# EasyEDA Pro project RackEth.eprj

# Schematic RackEth
Board Name: RackEth; Create Date: 2024-12-09; Page Name: RackEth; Project Name: RackEth; Schematic Name: RackEth; Update Date: 2025-03-17; Company: EasyEDA.com; Drawn: EasyEDA; Page Size: A4; Part Number: JLCPCB-002; Reviewed: EasyEDA; Version: V0.1
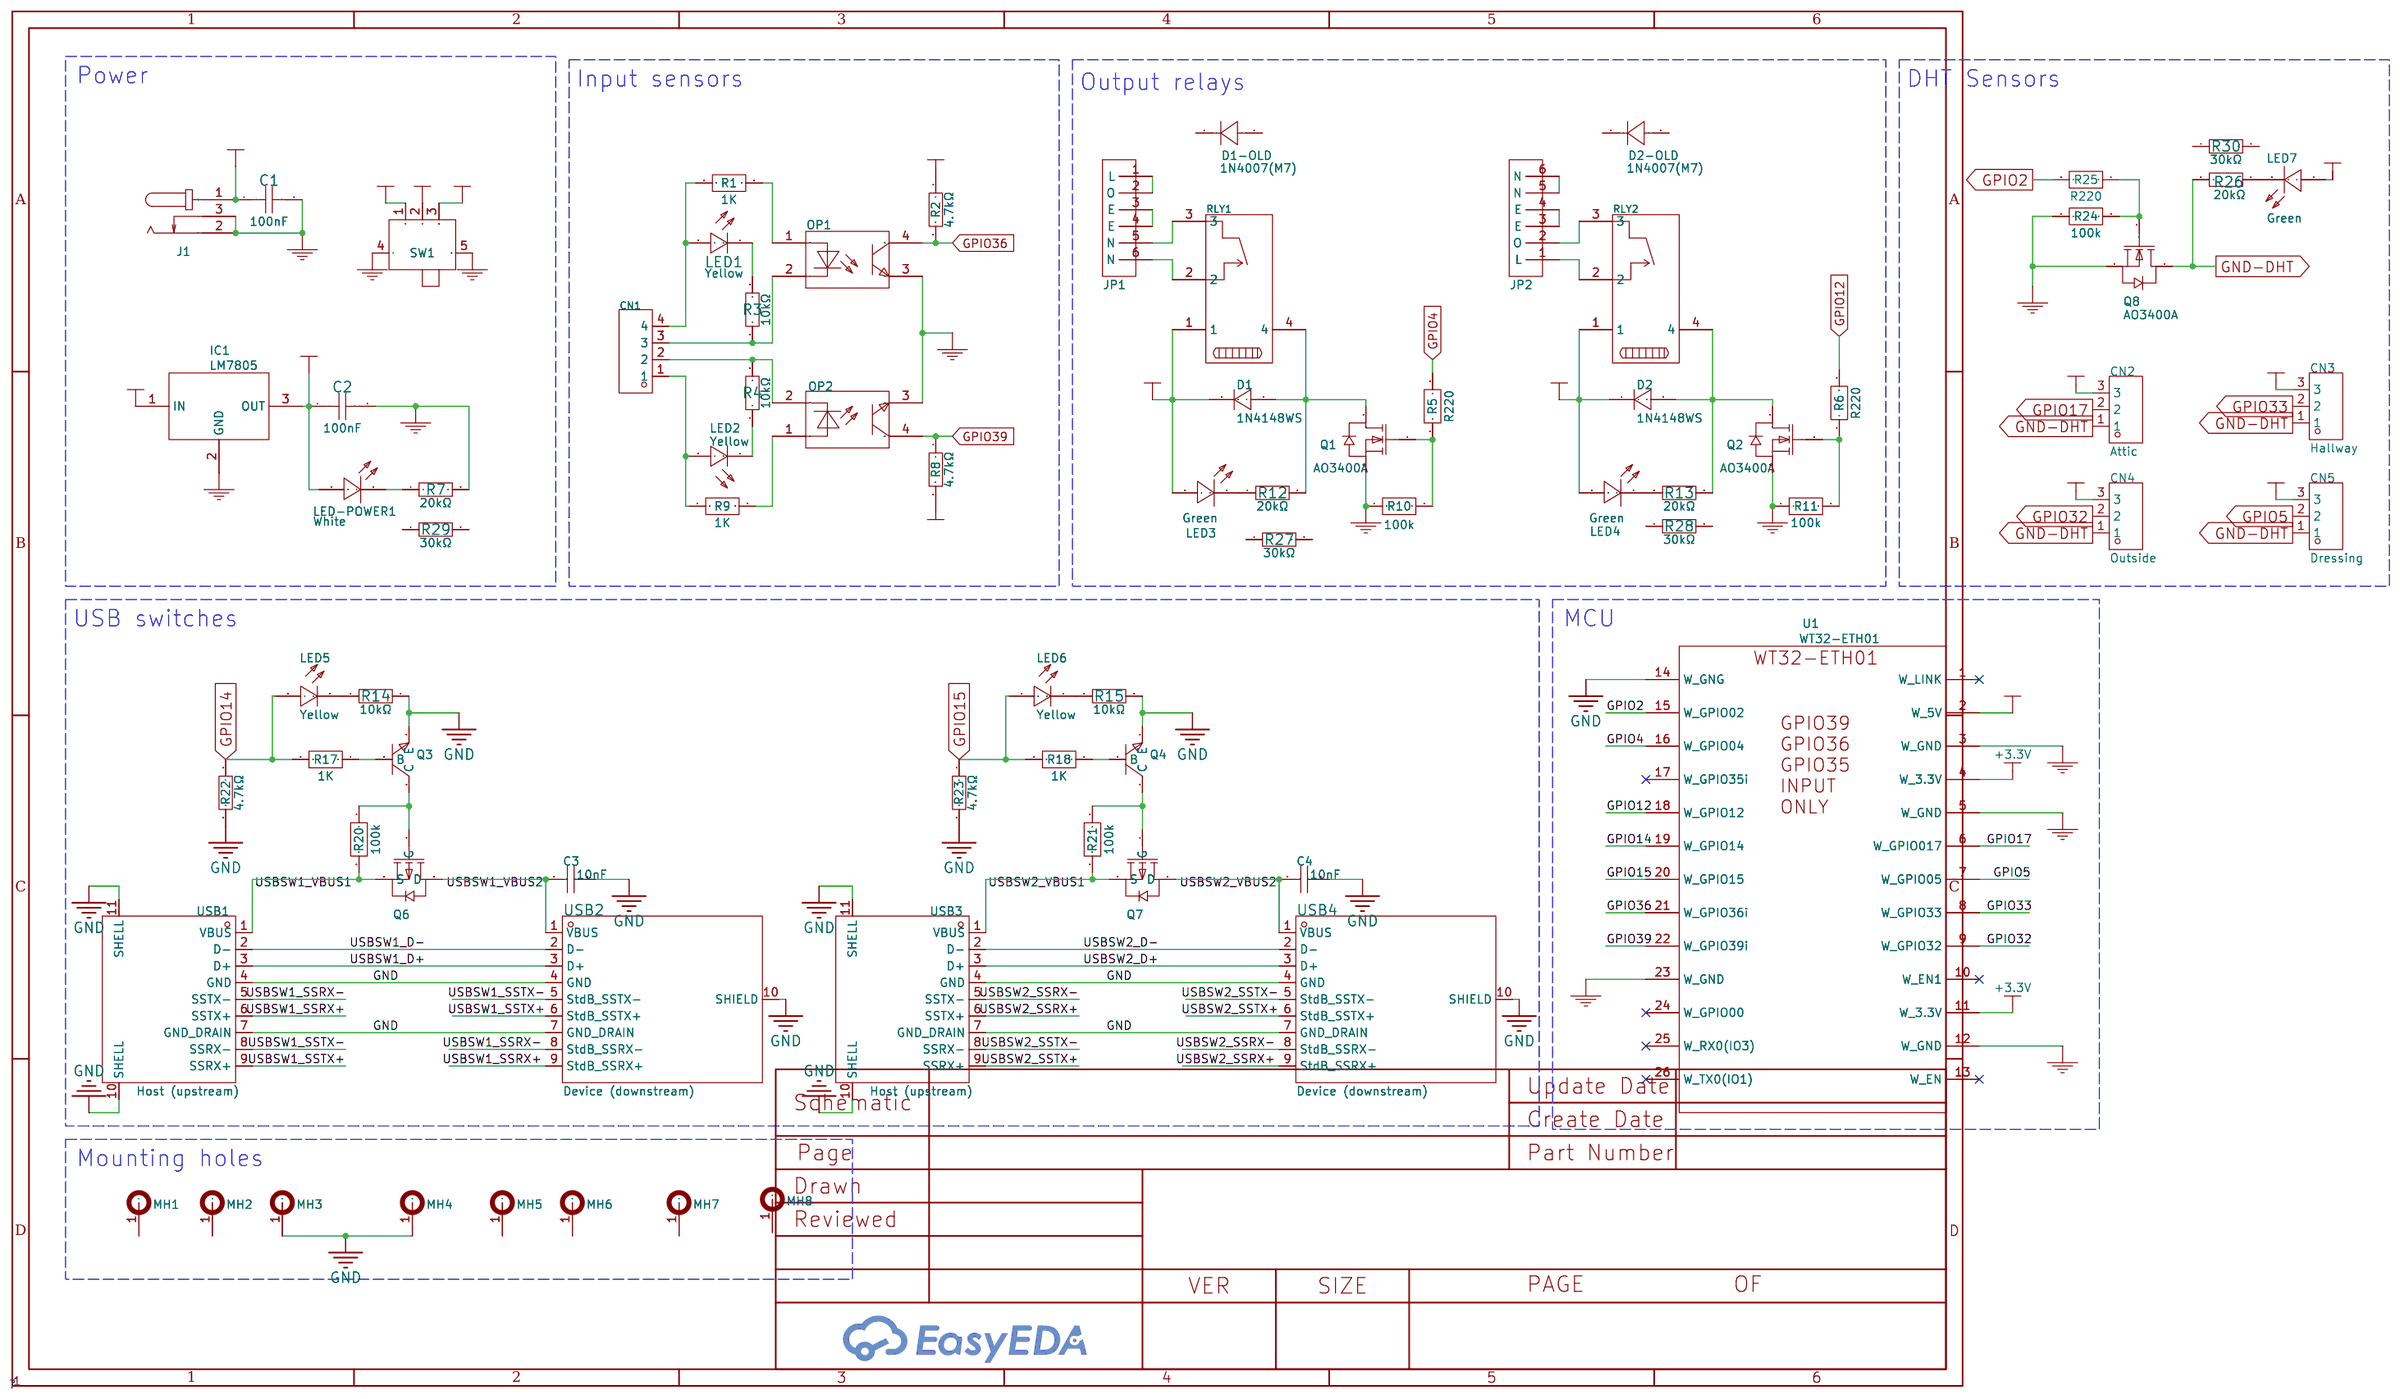
[diagram p0: schematic sheet]

## Parts
C1  100nF  [C0603]
C2  100nF  [C0603]
C3  10nF  [C0402]
C4  10nF  [C0402]
CN1  WJ127-5.0-4P  [CONN-TH_4P-P5.00_WJ127-5.0-4P]  (no BOM)
CN2  Attic  [CONN-TH_3P-P2.50_HCTL_XH-3A-L]  (no BOM)
CN3  Hallway  [CONN-TH_3P-P2.50_HCTL_XH-3A-L]  (no BOM)
CN4  Outside  [CONN-TH_3P-P2.50_HCTL_XH-3A-L]  (no BOM)
CN5  Dressing  [CONN-TH_3P-P2.50_HCTL_XH-3A-L]  (no BOM)
D1  1N4148WS  [SOD-323_L1.8-W1.3-LS2.5-RD]
D1-OLD  1N4007(M7)  [SMA_L4.3-W2.7-LS5.1-RD]  (no BOM)
D2  1N4148WS  [SOD-323_L1.8-W1.3-LS2.5-RD]
D2-OLD  1N4007(M7)  [SMA_L4.3-W2.7-LS5.1-RD]  (no BOM)
IC1  LM7805  [LM7805]  (no BOM)
J1  DC005-2.1x5.5mm  [DC-IN-TH_POWER-JACK]  (no BOM)
JP1  JP1  [CONN-TH_6P-P5.00_WJ127-5.0-6P]  (no BOM)
JP2  JP2  [CONN-TH_6P-P5.00_WJ127-5.0-6P]  (no BOM)
LED1  Yellow  [LED0603-RD-YELLOW]
LED2  Yellow  [LED0603-RD-YELLOW]
LED3  Green  [LED0805-RD_GREEN]
LED4  Green  [LED0805-RD_GREEN]
LED5  Yellow  [LED0603-RD-YELLOW]
LED6  Yellow  [LED0603-RD-YELLOW]
LED7  Green  [LED0805-RD_GREEN]
LED-POWER1  White  [LED0603-R-RD_WHITE]
MH1  -  [MH_7.5x4mm]  (no BOM)
MH2  -  [MH_7.5x4mm]  (no BOM)
MH3  -  [MH_7.5x4mm]  (no BOM)
MH4  -  [MH_7.5x4mm]  (no BOM)
MH5  -  [MH_6x3.2mm]  (no BOM)
MH6  -  [MH_6x3.2mm]  (no BOM)
MH7  -  [MH_6x3.2mm]  (no BOM)
MH8  -  [MH_6x3.2mm]  (no BOM)
OP1  EL817S1(C)(TU)-F  [OPTO-SMD-4_L4.6-W6.5-P2.54-LS10.3-TL]
OP2  EL817S1(C)(TU)-F  [OPTO-SMD-4_L4.6-W6.5-P2.54-LS10.3-TL]
Q1  AO3400A  [SOT-23-3_L2.9-W1.6-P1.90-LS2.8-BR]
Q2  AO3400A  [SOT-23-3_L2.9-W1.6-P1.90-LS2.8-BR]
Q3  MMBT3904(RANGE:100-300)  [SOT-23-3_L2.9-W1.3-P1.90-LS2.4-BR]
Q4  MMBT3904(RANGE:100-300)  [SOT-23-3_L2.9-W1.3-P1.90-LS2.4-BR]
Q6  AO3401A  [SOT-23_L2.9-W1.3-P1.90-LS2.4-BR]
Q7  AO3401A  [SOT-23_L2.9-W1.3-P1.90-LS2.4-BR]
Q8  AO3400A  [SOT-23-3_L2.9-W1.6-P1.90-LS2.8-BR]
R1  1K  [R0603]
R2  4.7kΩ  [R0603]
R3  10kΩ  [R0603]
R4  10kΩ  [R0603]
R5  R220  [R0603]
R6  R220  [R0603]
R7  20kΩ  [R0603]
R8  4.7kΩ  [R0603]
R9  1K  [R0603]
R10  100k  [R0603]
R11  100k  [R0603]
R12  20kΩ  [R0603]
R13  20kΩ  [R0603]
R14  10kΩ  [R0603]
R15  10kΩ  [R0603]
R17  1K  [R0603]
R18  1K  [R0603]
R20  100k  [R0603]
R21  100k  [R0603]
R22  4.7kΩ  [R0603]
R23  4.7kΩ  [R0603]
R24  100k  [R0603]
R25  R220  [R0603]
R26  20kΩ  [R0603]
R27  30kΩ  [R0603]  (no BOM)
R28  30kΩ  [R0603]  (no BOM)
R29  30kΩ  [R0603]  (no BOM)
R30  30kΩ  [R0603]  (no BOM)
RLY1  G5NB-1A-E-DC5V  [RELAY-TH_G5NB-1A-E-DCXX]  (no BOM)
RLY2  G5NB-1A-E-DC5V  [RELAY-TH_G5NB-1A-E-DCXX]  (no BOM)
SW1  SS12D07VG3 087  [SW-TH_SS12D07VG4]
U1  WT32-ETH01  [WT32-ETH01-M]  (no BOM)
USB1  Host (upstream)  [USB3.0-TH_U235-09XN-2XC2-002]
USB2  Device (downstream)  [USB3.0-A-SMD_916-862A205EY10200]
USB3  Host (upstream)  [USB3.0-TH_U235-09XN-2XC2-002]
USB4  Device (downstream)  [USB3.0-A-SMD_916-862A205EY10200]

## Library data of the parts
C1 C2 = CC0603KRX7R9BB104: LCSC Part Name: 100nF ±10% 50V; Supplier Part: C14663; Manufacturer: YAGEO(国巨); Supplier Footprint: 0603; JLCPCB Part Class: Basic Part; Datasheet: https://atta.szlcsc.com/upload/public/pdf/source/20180910/C282072_33301C7F631E79921B82A8DAC6BCC5B3.pdf; Supplier: LCSC; Tolerance: ±10%
C3 C4 = CL05B103KB5NNNC: LCSC Part Name: 10nF ±10% 50V; Supplier Part: C15195; Manufacturer: SAMSUNG(三星); Supplier Footprint: 0402; JLCPCB Part Class: Basic Part; Datasheet: https://atta.szlcsc.com/upload/public/pdf/source/20160218/1457707763339.pdf; Supplier: LCSC; Tolerance: ±10%
CN1 = WJ127-5.0-4P: LCSC Part Name: 5mm 1x4P 排数:1 每排P数:4 直插; Supplier Part: C192779; Manufacturer: KANGNEX(康奈克斯电气); Supplier Footprint: 插件,P=5mm; JLCPCB Part Class: Extended Part; Datasheet: https://atta.szlcsc.com/upload/public/pdf/source/20191225/C192779_DBD79F61C9FABD31EC3EFBBD98D95251.pdf; Supplier: LCSC; Structure: 1x4P; Pitch: 5mm; Color: Green; Mounting Style: Straight; Current Rating (Max): 15A; Voltage Rating (Max): 250V; Number of Pins: 4P; Number of Rows: 1; Wire Gauge - AWG: 14~26; Wire Gauge - mm2: 1.5; Number of PINs Per Row: 4; Operating Temperature Range: -40℃~+105℃
CN2-CN5 = XH2.54-3A: Supplier Part: C9900018379; Supplier: LCSC
D1 D2 = 1N4148WS_C2128: LCSC Part Name: 丝印T4; Supplier Part: C2128; Manufacturer: CJ(江苏长电/长晶); Supplier Footprint: SOD-323; JLCPCB Part Class: Basic Part; Datasheet: https://atta.szlcsc.com/upload/public/pdf/source/20140809/1457707208178.pdf; Supplier: LCSC; Diode Configuration: Independent Type; Forward Voltage (Vf@If): 1.25V@150mA; Reverse Leakage Current (Ir): 1uA@75V
D1-OLD D2-OLD = 1N4007(M7): Supplier: LCSC; Supplier Part: C2988638; Manufacturer: UMW(友台半导体); JLCPCB Part Class: Extended Part
IC1 = LM7805: sim: true
J1 = DC005-2.1x5.5mm: Supplier: LCSC; Supplier Part: C9900001795; Manufacturer: 索峰; Manufacturer Part: POWER-JACK; JLCPCB Part Class: Extended Part
JP1 JP2 = Terminal?: Supplier Part: 6P Terminal Block Connector 5.0mm; Supplier: Amazon; link: https://www.amazon.com/gp/product/B00NWEC8TW
LED1 LED2 LED5 LED6 = 19-213/Y2C-CQ2R2L/3T(CY): LCSC Part Name: 黄灯; Supplier Part: C72038; Manufacturer: EVERLIGHT(亿光); Supplier Footprint: 0603; JLCPCB Part Class: Basic Part; Datasheet: https://atta.szlcsc.com/upload/public/pdf/source/20160507/1462613613586.pdf; Supplier: LCSC; Power Dissipation: 60mW; Forward Current: 20mA; Dominant Wavelength: 585.5nm~591.5nm; Peak Wavelength: 591nm; Lens Color: 无色透明透镜; Viewing Angle: 120°; Operating Temperature: -40℃~+85℃
LED3 LED4 LED7 = 0805G (Green): Supplier: LCSC; Manufacturer: KENTO; Supplier Part: C2297; JLCPCB Part Class: Basic Part
LED-POWER1 = 0603White light_C2290: Supplier: LCSC; Manufacturer: KENTO; Manufacturer Part: KT-0603W; Supplier Part: C2290; JLCPCB Part Class: Basic Part
MH1-MH4 = MH_7.5x4mm
MH5-MH8 = MH_6x3.2mm
OP1 OP2 = EL817S1(C)(TU)-F: Supplier: LCSC; Manufacturer: EVERLIGHT(亿光); Supplier Part: C106900; JLCPCB Part Class: Basic Part
Q1 Q2 Q8 = AO3400A: Supplier: LCSC; Manufacturer: AOS; Supplier Part: C20917; JLCPCB Part Class: Basic Part
Q3 Q4 = MMBT3904(RANGE:100-300): Transistor Type: Collector Current (Ic): Collector-Emitter Breakdown Voltage (Vceo): Power Dissipation (Pd): DC Current Gain (hFE@Ic,Vce):100@10mA,1V DC Current Gain (hFE@Ic,Vce):100@10mA,1V Transition Frequency (fT):300MHz Collector Cut-Off Current (Icbo; LCSC Part Name: NPN 电流:200mA 耐压:40V hfe=100~300; Supplier Part: C20526; Manufacturer: CJ(江苏长电/长晶); Supplier Footprint: SOT-23; JLCPCB Part Class: Basic Part; Datasheet: https://atta.szlcsc.com/upload/public/pdf/source/20220704/70F575FB75061E03F919270A6BB8BA7F.pdf; Supplier: LCSC; DC Current Gain (hFE@Ic,Vce): 100@10mA,1V; Transition Frequency (fT): 300MHz; Collector Cut-Off Current (Icbo): 100nA; Collector-Emitter Saturation Voltage (VCE(sat)@Ic,Ib): 300mV@50mA,5mA
Q6 Q7 = AO3401A_C15127: Type:1 Piece P-Channel Drain Source Voltage (Vdss): Continuous Drain Current (Id): Drain Source On Resistance (RDS(on)@Vgs,Id):44mΩ@10V,4.3A Power Dissipation (Pd): Gate Threshold Voltage (Vgs(th)@Id):1.3V@250uA Total Gate Charge (Qg@Vgs):12.2nC@4.5V Inpu; LCSC Part Name: 1个P沟道 耐压:30V 电流:4A; Supplier Part: C15127; Manufacturer: AOS; Supplier Footprint: SOT-23; JLCPCB Part Class: Basic Part; Datasheet: https://atta.szlcsc.com/upload/public/pdf/source/20160507/1462613609053.pdf; Supplier: LCSC; Type: 1 Piece P-Channel; Drain Source On Resistance (RDS(on)@Vgs,Id): 44mΩ@10V,4.3A; Gate Threshold Voltage (Vgs(th)@Id): 1.3V@250uA; Total Gate Charge (Qg@Vgs): 12.2nC@4.5V; Input Capacitance (Ciss@Vds): 1.2nF@15V; Operating Temperature: -55℃~+150℃@(Tj)
R1 R9 R17 R18 = 1K: Supplier Part: C21190; Supplier: LCSC; Manufacturer Part: 0603WAF1001T5E; Manufacturer: UNI-ROYAL(厚声)
R2 R8 R22 R23 = 0603WAF4701T5E: LCSC Part Name: 4.7kΩ ±1% 100mW 厚膜电阻; Supplier Part: C23162; Manufacturer: UNI-ROYAL(厚声); Supplier Footprint: 0603; JLCPCB Part Class: Basic Part; Datasheet: https://atta.szlcsc.com/upload/public/pdf/source/20200306/C422600_1E6D84923E4A46A82E41ADD87F860B5C.pdf; Supplier: LCSC; Type: Thick Film Resistors; Tolerance: ±1%; Temperature Coefficient: ±100ppm/℃; Operating Temperature Range: -55℃~+155℃
R3 R4 R14 R15 = 0603WAF1002T5E: LCSC Part Name: 厚膜电阻 10kΩ ±1% 100mW; Supplier Part: C25804; Manufacturer: UNI-ROYAL(厚声); Supplier Footprint: 0603; JLCPCB Part Class: Basic Part; Datasheet: https://atta.szlcsc.com/upload/public/pdf/source/20200306/C422600_1E6D84923E4A46A82E41ADD87F860B5C.pdf; Supplier: LCSC; Type: Thick Film Resistors; Tolerance: ±1%; Temperature Coefficient: ±100ppm/℃; Operating Temperature Range: -55℃~+155℃
R5 R6 R25 = R220: Supplier Part: C22962; Supplier: LCSC; Manufacturer Part: 0603WAF2200T5E; Manufacturer: UNI-ROYAL(厚声)
R7 R12 R13 R26 = 0603WAF2002T5E: LCSC Part Name: 20kΩ ±1% 100mW 厚膜电阻; Supplier Part: C4184; Manufacturer: UNI-ROYAL(厚声); Supplier Footprint: 0603; JLCPCB Part Class: Basic Part; Datasheet: https://atta.szlcsc.com/upload/public/pdf/source/20200306/C422600_1E6D84923E4A46A82E41ADD87F860B5C.pdf; Supplier: LCSC; Type: Thick Film Resistors; Tolerance: ±1%; Temperature Coefficient: ±100ppm/℃; Operating Temperature Range: -55℃~+155℃
R10 R11 R20 R21 R24 = 100k: Supplier Part: C25803; Supplier: LCSC; Manufacturer Part: 0603WAF1003T5E; Manufacturer: UNI-ROYAL(厚声)
R27-R30 = 0603WAF3002T5E: LCSC Part Name: 30kΩ ±1% 100mW 厚膜电阻; Supplier Part: C22984; Manufacturer: UNI-ROYAL(厚声); Supplier Footprint: 0603; JLCPCB Part Class: Basic Part; Datasheet: https://atta.szlcsc.com/upload/public/pdf/source/20200306/C422600_1E6D84923E4A46A82E41ADD87F860B5C.pdf; Supplier: LCSC; Type: Thick Film Resistors; Tolerance: ±1%; Temperature Coefficient: ±100ppm/℃; Operating Temperature Range: -55℃~+155℃
RLY1 RLY2 = G5NB-1A-E-DC5V: Coil Voltage:- Contact Form:- Pin Number:- Contact Rating:- Maximum Switching Voltage:- Contact Material:- Maximum Switching Current:- Coil Type: Coil Resistance:- Contact Resistance:- Operate Time:- Release Time:- Operating Temperature:- Operating Temper; Supplier Part: C48746; Manufacturer: OMRON(欧姆龙); Supplier Footprint: 插件,7x20.4mm; JLCPCB Part Class: Extended Part; Supplier: LCSC
SW1 = SS12D07VG3 087: Supplier Part: C2939725; Manufacturer: SHOU HAN(首韩); Supplier Footprint: 插件; JLCPCB Part Class: Extended Part; Datasheet: https://atta.szlcsc.com/upload/public/pdf/source/20220106/77EDD450BA7545A1F1665F035F54D3A4.pdf; Supplier: LCSC; Circuit: SPDT; Pin Style: PCPin; Switch Length: 8.7mm; Switch Width: 4.4mm; Switch Height: 4.7mm; Mounting Style: Straight; Current Rating (DC): 500mA; Voltage Rating (DC): 50V; Mechanical Life: 5千次; Operating Temperature: -10℃~+50℃
U1 = WT32-ETH01: Manufacturer: Wireless-Tag; link: http://www.wireless-tag.com/wp-content/uploads/2020/08/WT32-ETH01规格书V1.2EN（英文）.pdf
USB1 USB3 = U235-091N-2UC2-002: LCSC Part Name: Type-B 母; Supplier Part: C2879842; Manufacturer: XKB Connection(中国星坤); Supplier Footprint: 插件; JLCPCB Part Class: Extended Part; Datasheet: https://atta.szlcsc.com/upload/public/pdf/source/20220919/F7A9F5F63B3D22A8342A73DEDBEAF374.pdf; Supplier: LCSC; Connector Type: Type-B; Gender: Female; Number of Contacts: 9P; Number of Ports: 1; Current Rating - Power (Max): 1.8A; Contact Material: Copper alloy; Contact Plating: Gold; Operating Temperature Range: -55℃~+85℃; Soldering Temperature(Max): 235℃
USB2 USB4 = 916-862A205EY10200: LCSC Part Name: Type-A 母 夹板; Supplier Part: C2763055; Manufacturer: 精拓金; Supplier Footprint: SMD; JLCPCB Part Class: Extended Part; Datasheet: https://atta.szlcsc.com/upload/public/pdf/source/20210526/C2763055_64B60A99F4A404C7F2E7F9F6F4497CDD.pdf; Supplier: LCSC; Connector Type: Type-A; Standard: USB 3.0; Gender: Female; Number of Ports: 1; Number of Contacts: 9P; Mounting Style: Board Edge, Straddle Mount; Current Rating - Power (Max): 1A; Operating Temperature Range: -25℃~+85℃

## Nets
+3.3V: CN2.3 CN3.3 CN4.3 CN5.3 LED7.2(A) R2.1 R8.2 U1.4(W_3.3V) U1.11(W_3.3V)
+5V: C2.1 D1.1(K) D2.1(K) IC1.3(OUT) LED3.2(A) LED4.2(A) LED-POWER1.1(A) RLY1.1 RLY2.1 SW1.1 U1.2(W_5V)
GND: C1.2 C2.2 C3.1 C4.1 IC1.2(GND) J1.2(GND) J1.3 MH3.1 MH4.1 OP1.3(EM) OP2.3(EM) Q1.2(S) Q2.2(S) Q3.2(E) Q4.2(E) Q8.2(S) R7.2 R10.1 R11.1 R14.1 R15.1 R22.2 R23.2 R24.1 SW1.4 SW1.5 U1.3(W_GND) U1.5(W_GND) U1.12(W_GND) U1.14(W_GNG) U1.23(W_GND) USB1.4(GND) USB1.7(GND_DRAIN) USB1.10(SHELL) USB1.11(SHELL) USB2.4(GND) USB2.7(GND_DRAIN) USB2.10(SHIELD) USB3.4(GND) USB3.7(GND_DRAIN) USB3.10(SHELL) USB3.11(SHELL) USB4.4(GND) USB4.7(GND_DRAIN) USB4.10(SHIELD)
GND-DHT: CN2.1 CN3.1 CN4.1 CN5.1 Q8.3(D) R26.2
VCC: IC1.1(IN) SW1.3
VCC-IN: C1.1 J1.1(VCC) SW1.2
GPIO2: R25.2 U1.15(W_GPIO02)
GPIO4: R5.2 U1.16(W_GPIO04)
GPIO5: CN5.2 U1.7(W_GPIO05)
GPIO12: R6.2 U1.18(W_GPIO12)
GPIO14: LED5.2(A) R17.2 R22.1 U1.19(W_GPIO14)
GPIO15: LED6.2(A) R18.2 R23.1 U1.20(W_GPIO15)
GPIO17: CN2.2 U1.6(W_GPIO017)
GPIO32: CN4.2 U1.9(W_GPIO32)
GPIO33: CN3.2 U1.8(W_GPIO33)
GPIO36: OP1.4(COL) R2.2 U1.21(W_GPIO36i)
GPIO39: OP2.4(COL) R8.1 U1.22(W_GPIO39i)
USBSW1_D+: USB1.3(D+) USB2.3(D+)
USBSW1_D-: USB1.2(D-) USB2.2(D-)
USBSW1_SSRX+: USB1.6(SSTX+) USB2.9(StdB_SSRX+)
USBSW1_SSRX-: USB1.5(SSTX-) USB2.8(StdB_SSRX-)
USBSW1_SSTX+: USB1.9(SSRX+) USB2.6(StdB_SSTX+)
USBSW1_SSTX-: USB1.8(SSRX-) USB2.5(StdB_SSTX-)
USBSW1_VBUS1: Q6.2(S) R20.2 USB1.1(VBUS)
USBSW1_VBUS2: C3.2 Q6.3(D) USB2.1(VBUS)
USBSW2_D+: USB3.3(D+) USB4.3(D+)
USBSW2_D-: USB3.2(D-) USB4.2(D-)
USBSW2_SSRX+: USB3.6(SSTX+) USB4.9(StdB_SSRX+)
USBSW2_SSRX-: USB3.5(SSTX-) USB4.8(StdB_SSRX-)
USBSW2_SSTX+: USB3.9(SSRX+) USB4.6(StdB_SSTX+)
USBSW2_SSTX-: USB3.8(SSRX-) USB4.5(StdB_SSTX-)
USBSW2_VBUS1: Q7.2(S) R21.2 USB3.1(VBUS)
USBSW2_VBUS2: C4.2 Q7.3(D) USB4.1(VBUS)
$1N3: D1.2(A) Q1.3(D) R12.2 RLY1.4
$1N5: Q1.1(G) R5.1 R10.2
$1N16: LED-POWER1.2(K) R7.1
$1N18: D2.2(A) Q2.3(D) R13.2 RLY2.4
$1N19: LED4.1(K) R13.1
$1N25: Q2.1(G) R6.1 R11.2
$1N58: OP1.1(AN) R1.1
$1N59: CN1.4 LED1.2(A) R1.2
$1N4552: JP2.3(E) JP2.4(E)
$1N4588: JP1.6(N) RLY1.2
$1N4592: JP1.5(N) RLY1.3
$1N4597: JP1.3(E) JP1.4(E)
$1N4602: JP1.1(L) JP1.2(O)
$1N4658: JP2.2(O) RLY2.3
$1N4661: JP2.1(L) RLY2.2
$1N4663: JP2.5(N) JP2.6(N)
$1N12669: CN1.3 OP1.2(CAT) R3.1
$1N27876: CN1.2 OP2.2(CAT) R4.2
$1N27969: LED1.1(C) R3.2
$1N27997: CN1.1 LED2.2(A) R9.1
$1N28002: OP2.1(AN) R9.2
$1N28006: LED2.1(C) R4.1
$1N30826: LED3.1(K) R12.1
$1N38985: Q3.1(B) R17.1
$1N38986: Q3.3(C) Q6.1(G) R20.1
$1N41846: Q4.1(B) R18.1
$1N41847: Q4.3(C) Q7.1(G) R21.1
$1N49685: LED5.1(C) R14.2
$1N49709: LED6.1(C) R15.2
$1N52596: Q8.1(G) R24.2 R25.1
$1N53145: LED7.1(K) R26.1

Not connected (* = marked no-connect by the designer): D1-OLD 1(K) 2(A); D2-OLD 1(K) 2(A); MH1 1; MH2 1; MH5 1; MH6 1; MH7 1; MH8 1; R27 1 2; R28 1 2; R29 1 2; R30 1 2; U1 1(W_LINK)* 10(W_EN1)* 13(W_EN)* 17(W_GPIO35i)* 24(W_GPIO00)* 25(W_RX0(IO3))* 26(W_TX0(IO1))*

## Notes on the sheet
- Power
- Input sensors
- Output relays
- DHT Sensors
- USB switches
- MCU
- Mounting holes

# Board RackEth
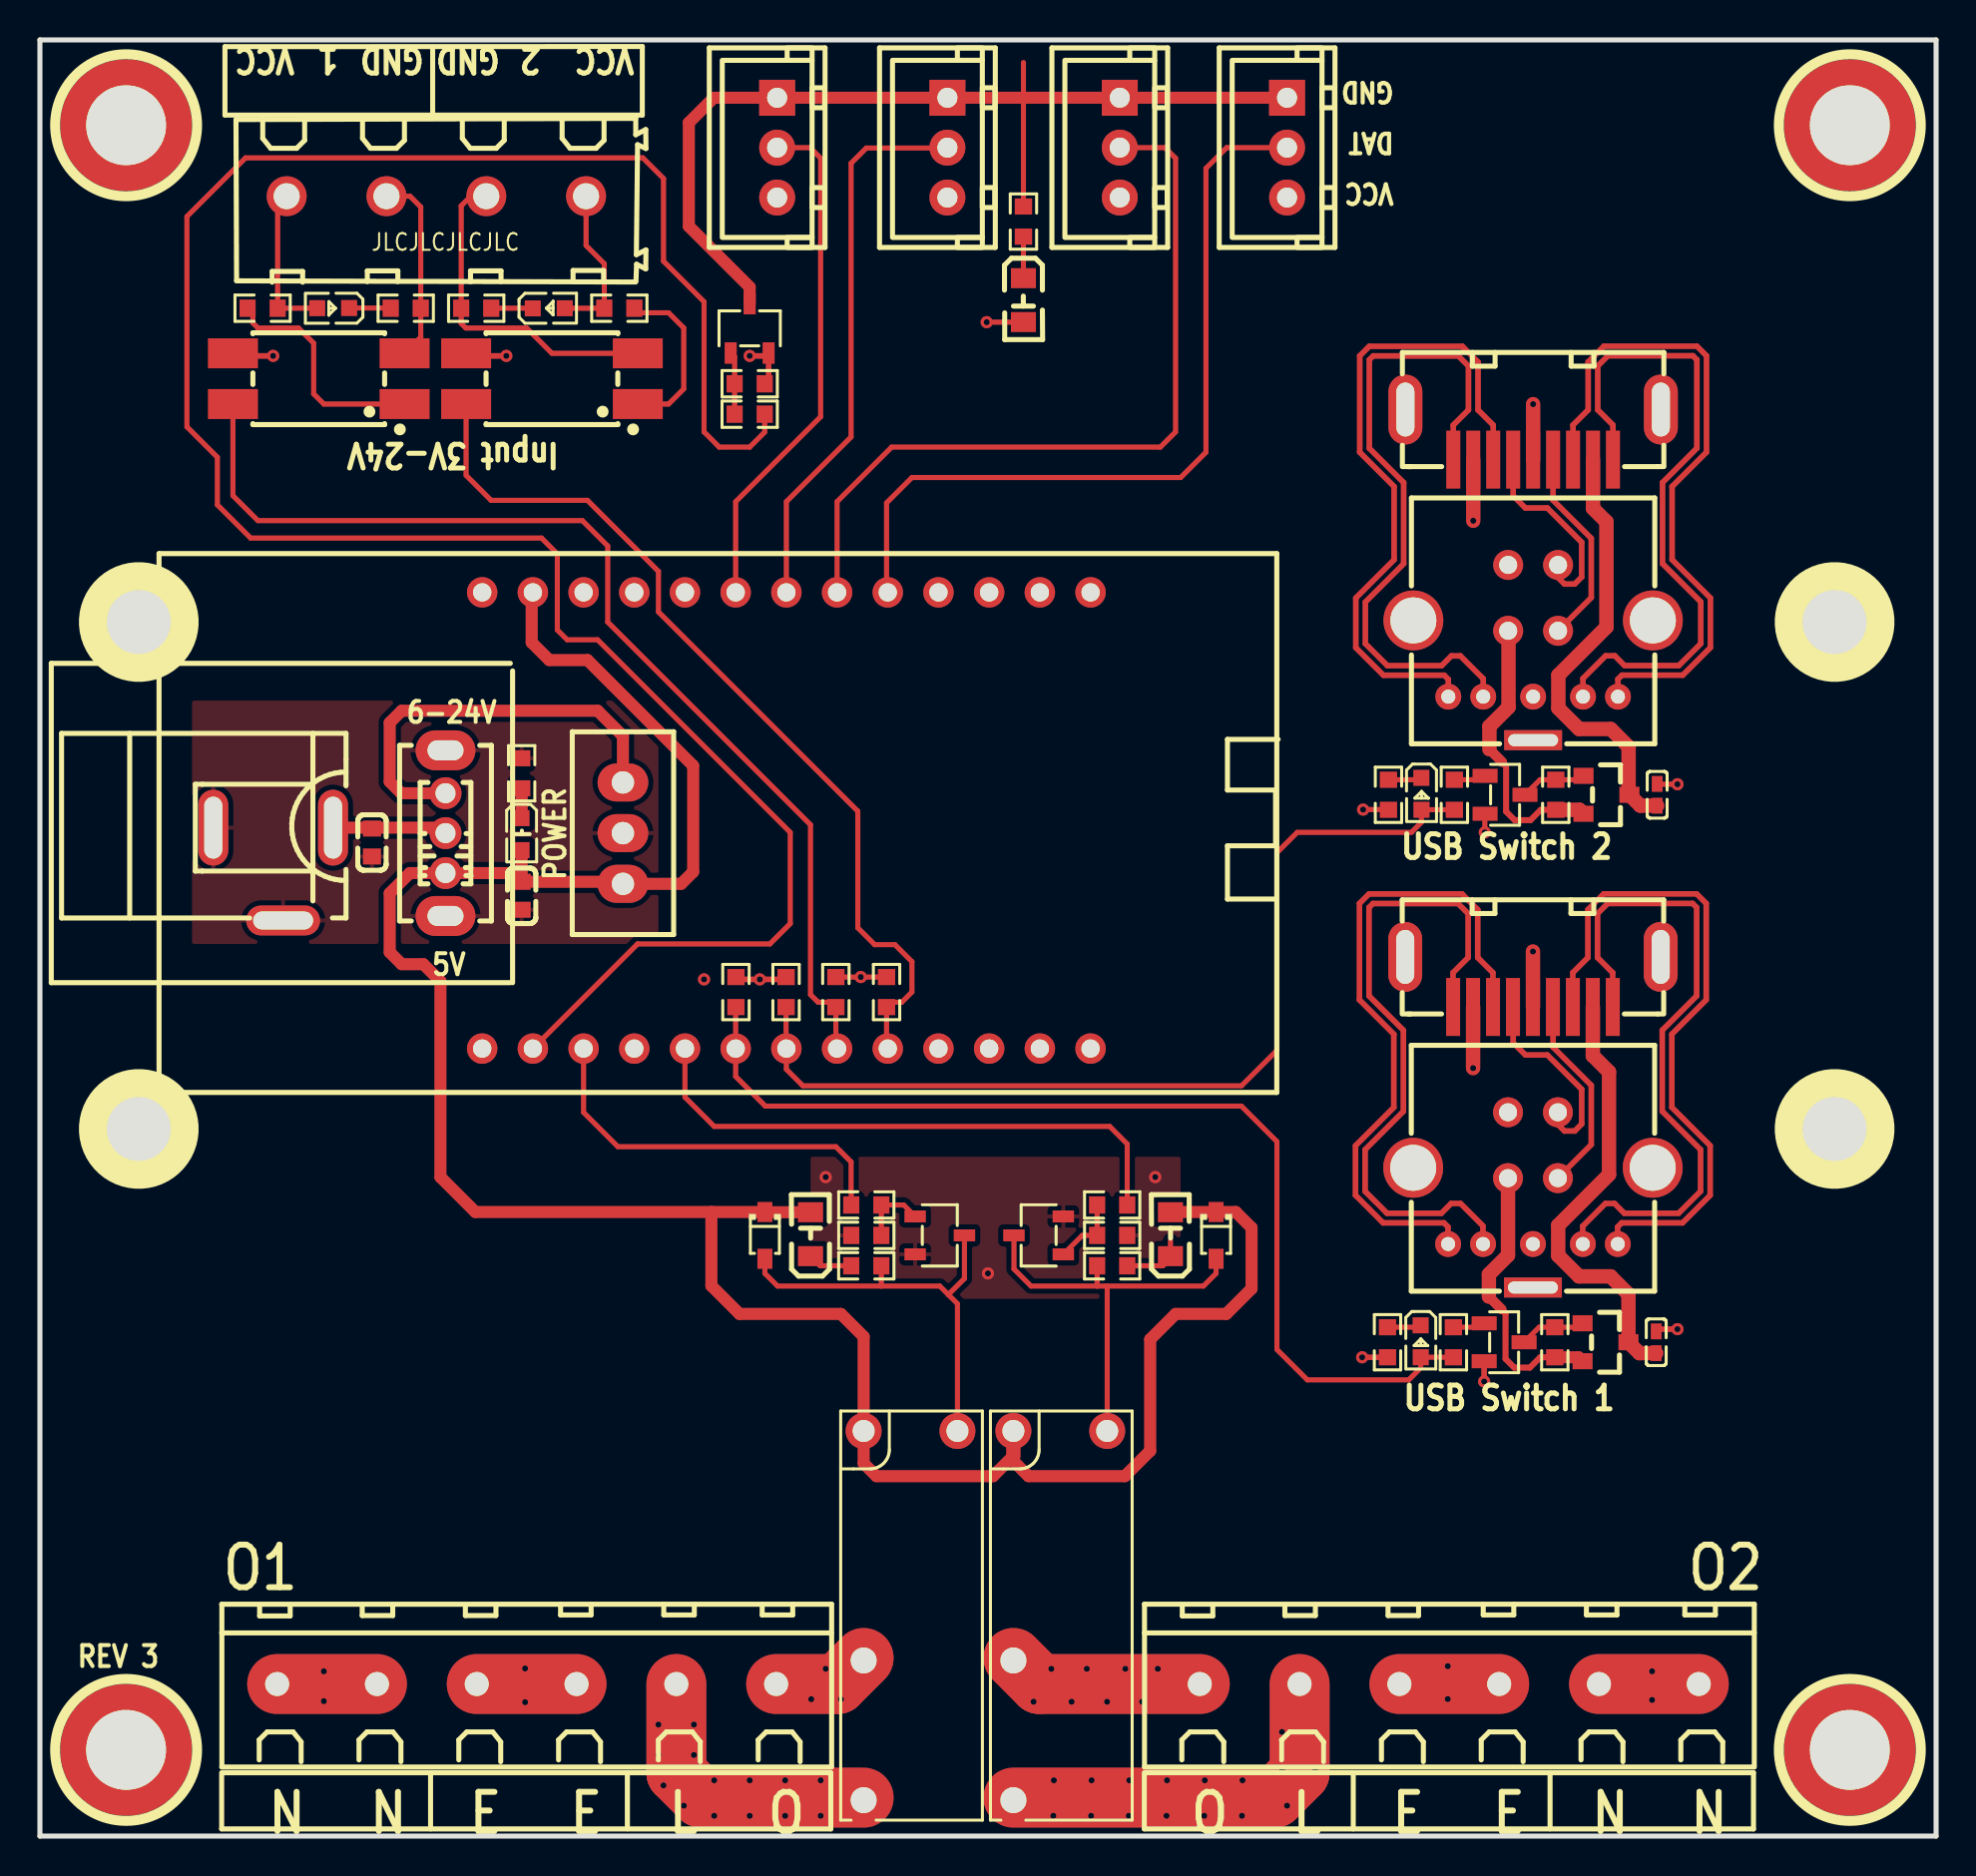
[diagram p1: board, top side]
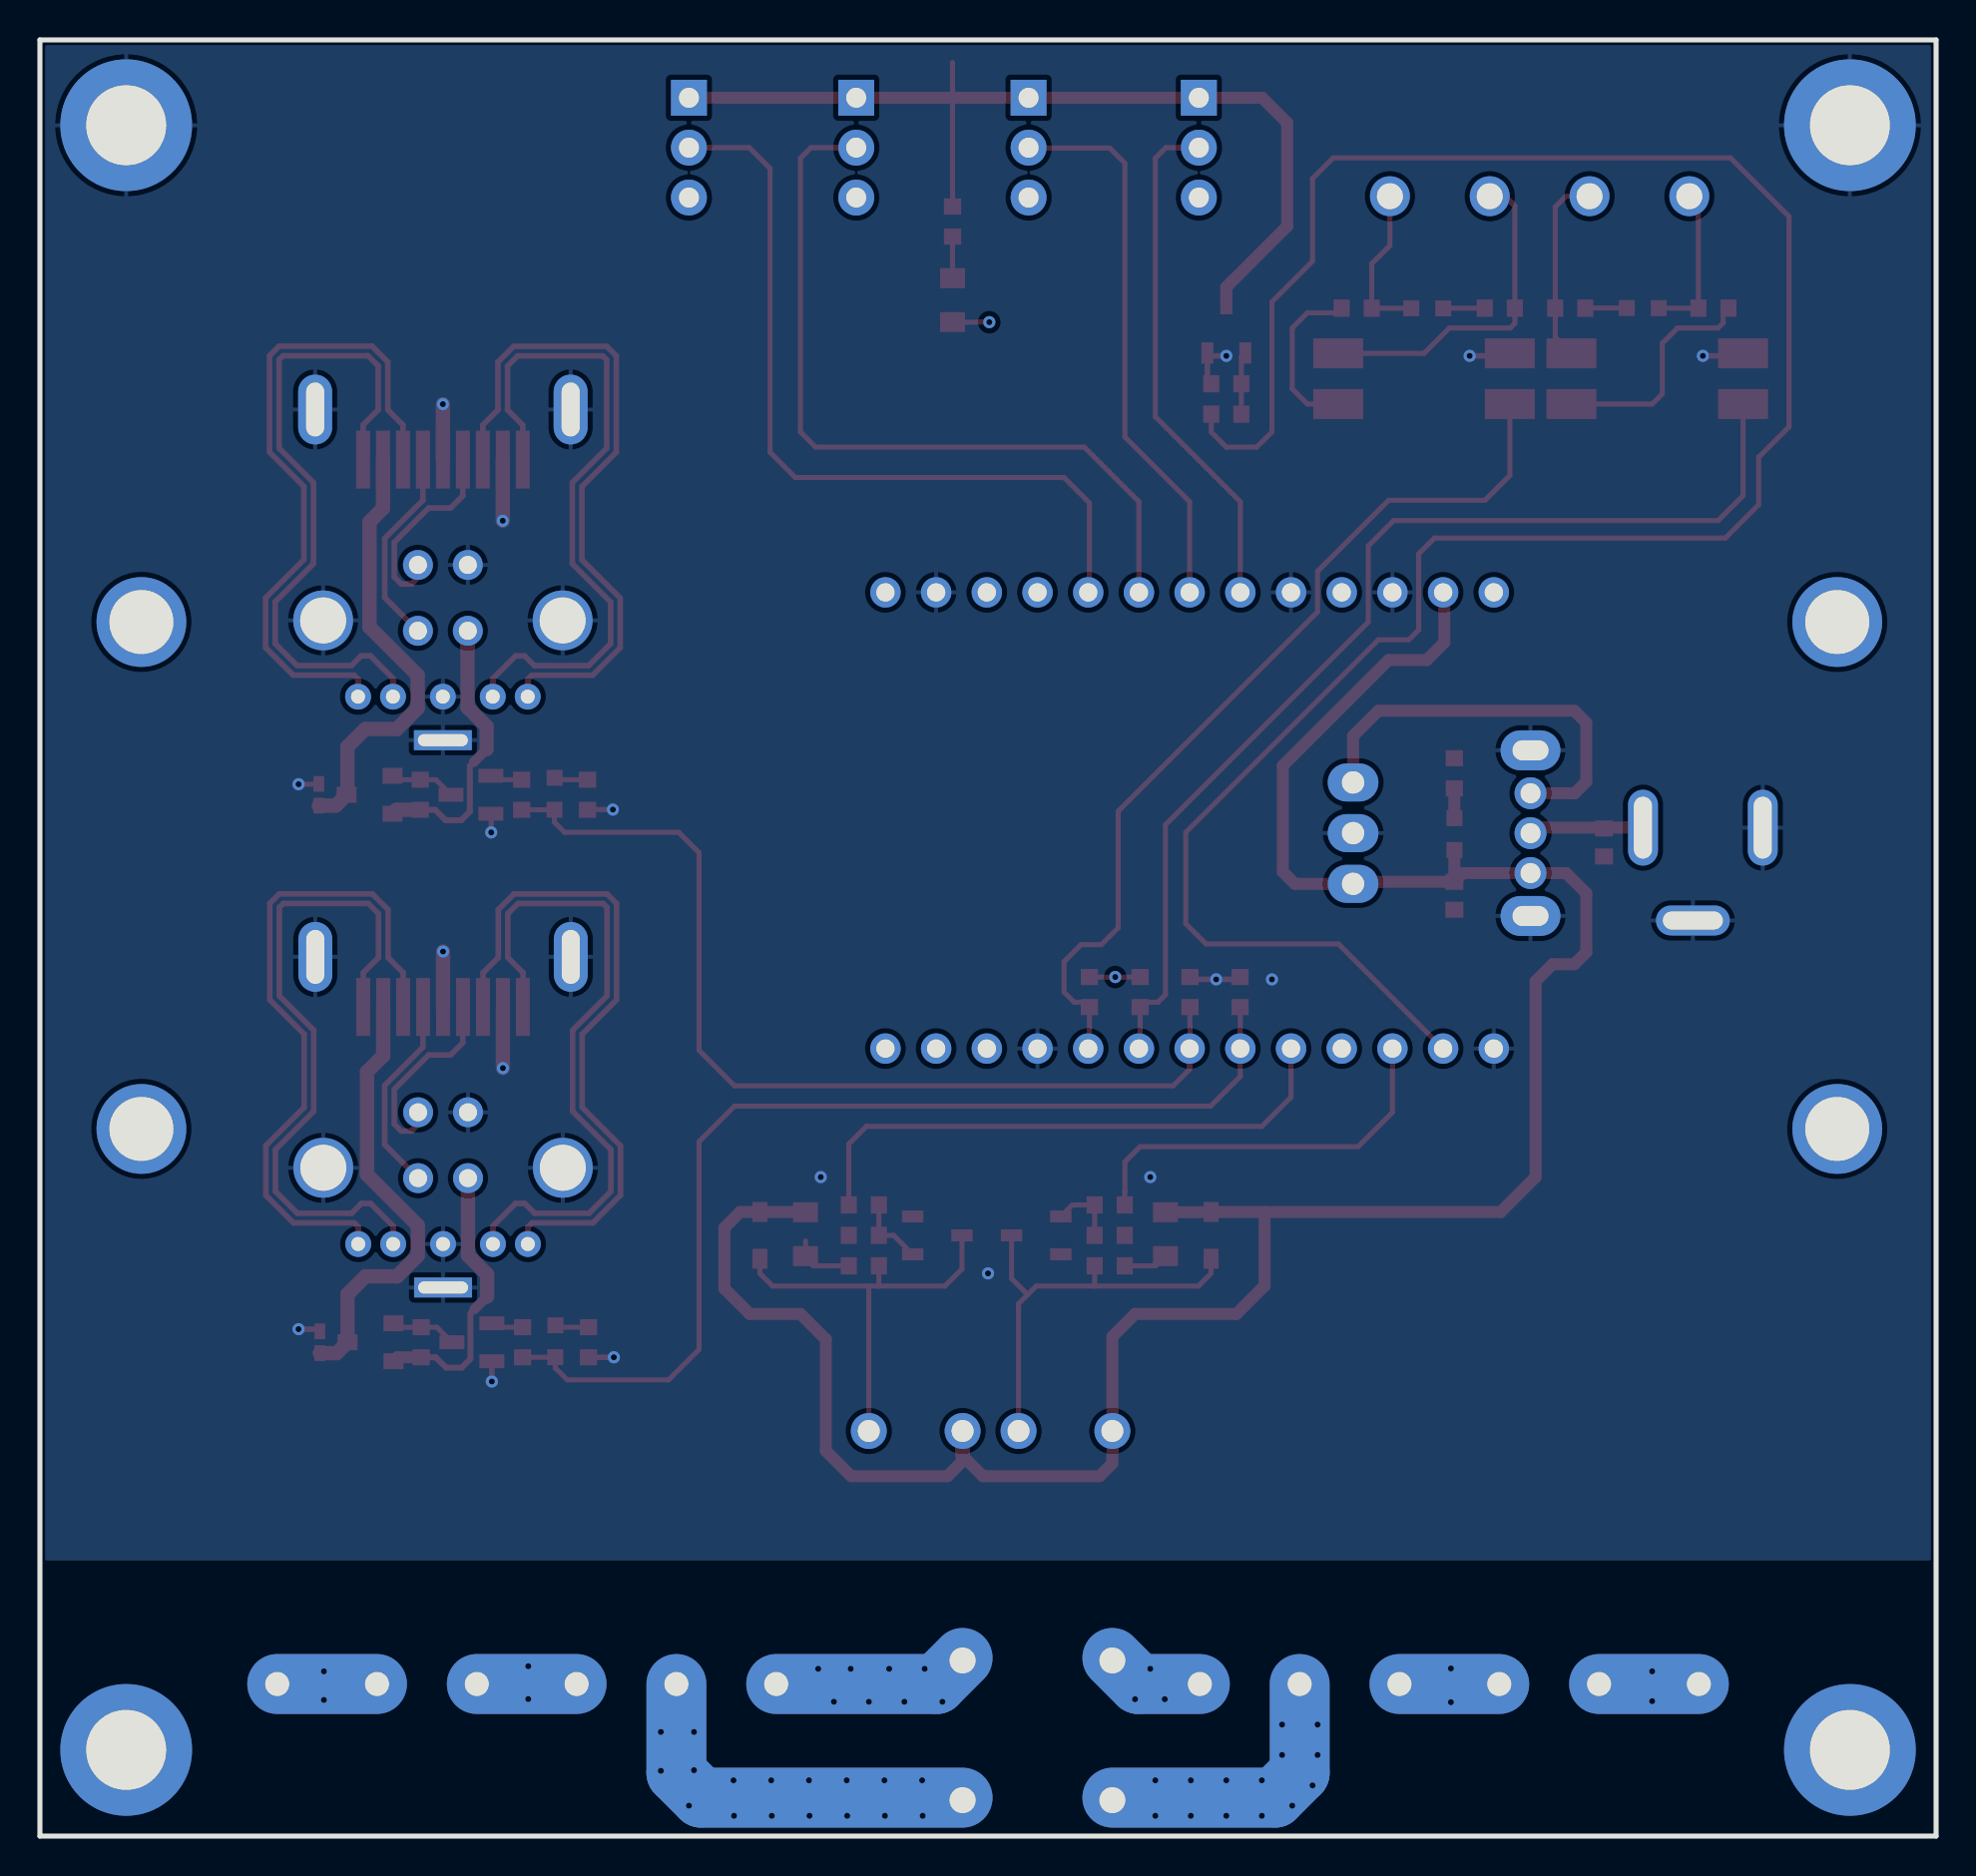
[diagram p2: board, bottom side, seen from below]

Outline 95 x 90 mm; copper layers: Top Layer, Inner1, Inner2, Bottom Layer. Coordinates in mm from the lower left corner of the outline.
Outline path: 0,90 95,90 95,0 0,0 0,90
Stack: Top Layer 0.035mm Outer layer thickness 1oz / Dielectric1 0.2104mm 7628 RC49% 8.6mil / Inner1 0.0152mm Inner layer thickness / Dielectric2 1.065mm 1.1mm H/HOZ Copper / Inner2 0.0152mm Inner layer thickness / Dielectric3 0.2104mm 7628 RC49% 8.6mil / Bottom Layer 0.035mm Outer layer thickness 1oz

## Design rules (mm)
net USBSW1_D-: USBSW1_D
net USBSW1_D+: USBSW1_D
net USBSW1_SSTX+: USBSW1_SSTX
net USBSW1_SSTX-: USBSW1_SSTX
net USBSW1_SSRX+: USBSW1_SSRX
net USBSW1_SSRX-: USBSW1_SSRX
net USBSW2_D-: USBSW2_D
net USBSW2_D+: USBSW2_D
net USBSW2_SSTX+: USBSW2_SSTX
net USBSW2_SSTX-: USBSW2_SSTX
net USBSW2_SSRX+: USBSW2_SSRX
net USBSW2_SSRX-: USBSW2_SSRX
template: GME 4-layers
spacing copperThickness1oz (default): track to track 0.102, other pairs 0.152 to 0.3
spacing copperThickness2oz: track to track 0.203, other pairs 0.152 to 0.3
spacing copperThicknessInner0.5oz: track to track 0.089, other pairs 0.152 to 0.3
track width copperThickness1oz (default): min 0.102, default 0.254, max 3
track width copperThickness0.5oz: min 0.089, default 0.254, max 2.54
track width copperThickness2oz: min 0.203, default 0.254, max 2.54
differential pair differentialPair (default): width min 0.28, default 0.28, max 0.28; gap min 0.2, default 0.2
via viaSize (default): diameter min 0.3, default 0.61, max 10; hole min 0.2, default 0.305, max 6.3

## Placement (name value [footprint] x y rotation side)
C1  100nF  [C0603]  16.64 49.78 270 top
C2  100nF  [C0603]  24.14 47.11 270 top
C3  10nF  [C0402]  80.98 24.74 270 top
C4  10nF  [C0402]  81.03 52.18 270 top
CN1  WJ127-5.0-4P  [CONN-TH_4P-P5.00_WJ127-5.0-4P]  19.86 82.17 180 top
CN2  Attic  [CONN-TH_3P-P2.50_HCTL_XH-3A-L]  36.94 84.6 90 top
CN3  Hallway  [CONN-TH_3P-P2.50_HCTL_XH-3A-L]  54.1 84.6 90 top
CN4  Outside  [CONN-TH_3P-P2.50_HCTL_XH-3A-L]  62.48 84.6 90 top
CN5  Dressing  [CONN-TH_3P-P2.50_HCTL_XH-3A-L]  45.47 84.6 90 top
D1  1N4148WS  [SOD-323_L1.8-W1.3-LS2.5-RD]  36.32 30.1 270 top
D2  1N4148WS  [SOD-323_L1.8-W1.3-LS2.5-RD]  58.93 30.1 270 top
IC1  -  [LM7805]  29.21 50.25 270 top
J1  DC005-2.1x5.5mm  [DC-IN-TH_POWER-JACK]  11.68 48.2 0 top
JP1  JP1  [CONN-TH_6P-P5.00_WJ127-5.0-6P]  24.39 7.62 0 top
JP2  JP2  [CONN-TH_6P-P5.00_WJ127-5.0-6P]  70.61 7.62 0 top
LED1  Yellow  [LED0603-RD-YELLOW]  14.69 76.56 180 top
LED2  Yellow  [LED0603-RD-YELLOW]  25.49 76.55 0 top
LED3  Green  [LED0805-RD_GREEN]  38.61 30.16 270 top
LED4  Green  [LED0805-RD_GREEN]  56.64 30.16 270 top
LED5  Yellow  [LED0603-RD-YELLOW]  69.18 24.79 270 top
LED6  Yellow  [LED0603-RD-YELLOW]  69.22 52.23 270 top
LED7  Green  [LED0805-RD_GREEN]  49.28 76.96 90 top
LED-POWER1  White  [LED0603-R-RD_WHITE]  24.13 50.2 270 top
MH1  -  [MH_7.5x4mm]  4.32 4.32 0 top
MH2  -  [MH_7.5x4mm]  90.68 4.32 0 top
MH3  -  [MH_7.5x4mm]  90.68 85.72 0 top
MH4  -  [MH_7.5x4mm]  4.32 85.72 0 top
MH5  -  [MH_6x3.2mm]  4.95 35.43 0 top
MH6  -  [MH_6x3.2mm]  4.95 60.83 0 top
MH7  -  [MH_6x3.2mm]  89.92 60.83 0 top
MH8  -  [MH_6x3.2mm]  89.92 35.43 0 top
OP1  EL817S1(C)(TU)-F  [OPTO-SMD-4_L4.6-W6.5-P2.54-LS10.3-TL]  13.97 73.03 180 top
OP2  EL817S1(C)(TU)-F  [OPTO-SMD-4_L4.6-W6.5-P2.54-LS10.3-TL]  25.65 73.03 180 top
Q1  AO3400A  [SOT-23-3_L2.9-W1.6-P1.90-LS2.8-BR]  45.09 30.1 0 top
Q2  AO3400A  [SOT-23-3_L2.9-W1.6-P1.90-LS2.8-BR]  50.04 30.1 180 top
Q3  MMBT3904(RANGE:100-300)  [SOT-23-3_L2.9-W1.3-P1.90-LS2.4-BR]  73.36 24.74 180 top
Q4  MMBT3904(RANGE:100-300)  [SOT-23-3_L2.9-W1.3-P1.90-LS2.4-BR]  73.41 52.18 180 top
Q6  AO3401A  [SOT-23_L2.9-W1.3-P1.90-LS2.4-BR]  78.44 24.74 180 top
Q7  AO3401A  [SOT-23_L2.9-W1.3-P1.90-LS2.4-BR]  78.49 52.18 180 top
Q8  AO3400A  [SOT-23-3_L2.9-W1.6-P1.90-LS2.8-BR]  35.56 75.55 90 top
R1  1K  [R0603]  11.16 76.56 0 top
R2  4.7kΩ  [R0603]  39.88 42.29 270 top
R3  10kΩ  [R0603]  18.33 76.56 180 top
R4  10kΩ  [R0603]  21.86 76.56 180 top
R5  R220  [R0603]  41.4 31.62 180 top
R6  R220  [R0603]  53.72 31.62 0 top
R7  20kΩ  [R0603]  24.14 53.25 90 top
R8  4.7kΩ  [R0603]  42.42 42.29 90 top
R9  1K  [R0603]  29.03 76.56 0 top
R10  100k  [R0603]  41.4 30.1 0 top
R11  100k  [R0603]  53.72 30.1 180 top
R12  20kΩ  [R0603]  41.4 28.58 0 top
R13  20kΩ  [R0603]  53.72 28.58 180 top
R14  10kΩ  [R0603]  67.52 24.74 90 top
R15  10kΩ  [R0603]  67.56 52.18 90 top
R17  1K  [R0603]  70.82 24.74 270 top
R18  1K  [R0603]  70.87 52.18 270 top
R20  100k  [R0603]  75.9 24.74 270 top
R21  100k  [R0603]  75.95 52.18 270 top
R22  4.7kΩ  [R0603]  34.87 42.29 90 top
R23  4.7kΩ  [R0603]  37.38 42.29 90 top
R24  100k  [R0603]  35.56 72.77 180 top
R25  R220  [R0603]  35.56 71.25 0 top
R26  20kΩ  [R0603]  49.28 80.9 90 top
RLY1  G5NB-1A-E-DC5V  [RELAY-TH_G5NB-1A-E-DCXX]  43.62 11.05 270 top
RLY2  G5NB-1A-E-DC5V  [RELAY-TH_G5NB-1A-E-DCXX]  51.12 11.05 270 top
SW1  SS12D07VG3 087  [SW-TH_SS12D07VG4]  20.32 50.25 90 top
U1  WT32-ETH01  [WT32-ETH01-M]  35.69 50.29 0 top
USB1  Host (upstream)  [USB3.0-TH_U235-09XN-2XC2-002]  74.8 31.88 180 top
USB2  Device (downstream)  [USB3.0-A-SMD_916-862A205EY10200]  74.8 42.8 180 top
USB3  Host (upstream)  [USB3.0-TH_U235-09XN-2XC2-002]  74.81 59.3 180 top
USB4  Device (downstream)  [USB3.0-A-SMD_916-862A205EY10200]  74.81 70.22 180 top

## Footprints (pads in the part's own frame, mm; a bottom-side part is the same pattern mirrored in y, then rotated)
C0402
  rect 0.79x0.54 smd: 1(-0.545,0) 2(0.545,0)
C0603
  rect 0.8x0.9 smd: 1(-0.7,0) 2(0.7,0)
CONN-TH_3P-P2.50_HCTL_XH-3A-L
  rect 1.8x1.8 hole 1: 1(2.5,0)
  round 1.8 hole 1: 2(0,0) 3(-2.5,0)
CONN-TH_4P-P5.00_WJ127-5.0-4P
  round 2 hole 1.3: 1(-7.5,0) 2(-2.5,0) 3(2.5,0) 4(7.5,0)
CONN-TH_6P-P5.00_WJ127-5.0-6P
  round 2.5 hole 1.2: 1(-12.5,0) 2(-7.5,0) 3(-2.5,0) 4(2.5,0) 5(7.5,0) 6(12.5,0)
DC-IN-TH_POWER-JACK
  oval 1.5x3.8 hole 0.9x3.1: 1(3,2.325) 2(-2.999,2.325)
  oval 3.7x1.5 hole 3x0.9: 3(0.5,-2.325)
LED0603-R-RD_WHITE
  rect 0.8x0.8 smd: 1(0.8,0) 2(-0.8,0)
LED0603-RD-YELLOW
  rect 0.8x0.8 smd: 1(-0.799,-0.004) 2(0.799,0.004)
LED0805-RD_GREEN
  rect 1x1.25 smd: 1(1.1,0) 2(-1.099,0)
LM7805
  oval 1.905x2.54 hole 1.117: 1(-2.54,0) 2(0,0) 3(2.54,0)
MH_6x3.2mm
  round 4.5 hole 3.2: 1(0,0)
MH_7.5x4mm
  round 6.6 hole 4: 1(0,0)
OPTO-SMD-4_L4.6-W6.5-P2.54-LS10.3-TL
  rect 2.5x1.5 smd: 1(-4.3,1.27) 2(-4.3,-1.27) 3(4.3,-1.27) 4(4.3,1.27)
R0603
  rect 0.806x0.864 smd: 1(-0.753,0) 2(0.753,0)
RELAY-TH_G5NB-1A-E-DCXX
  round 1.8 hole 1.1: 1(-9.25,-2.35) 4(-9.25,2.35)
  round 2 hole 1.3: 2(2.25,-2.35) 3(9.25,-2.35)
SOD-323_L1.8-W1.3-LS2.5-RD
  rect 1x0.75 smd: 1(-1.173,0) 2(1.173,0)
SOT-23-3_L2.9-W1.3-P1.90-LS2.4-BR
  rect 1.25x0.7 smd: 1(1,-0.95) 2(1,0.95) 3(-1,0)
SOT-23-3_L2.9-W1.6-P1.90-LS2.8-BR
  rect 1.07x0.6 smd: 1(-1.235,0.95) 2(-1.235,-0.95) 3(1.236,0)
SOT-23_L2.9-W1.3-P1.90-LS2.4-BR
  rect 1x0.8 smd: 1(1.15,-0.95) 2(1.15,0.95) 3(-1.15,0)
SW-TH_SS12D07VG4
  oval 1.6x1.6 hole 1: 1(-2,0) 2(0,0) 3(2,0)
  oval 2x3 hole 1x1.8: 4(4.15,0) 5(-4.15,0)
USB3.0-A-SMD_916-862A205EY10200
  rect 0.7x2.9 smd: 1(-3,1.255) 2(-1,1.255) 3(1,1.255) 4(3,1.255) 5(4,1.255) 6(2,1.255) 7(0,1.255) 8(-2,1.255) 9(-4,1.255)
  oval 1.7x3.5 hole 0.9x2.7: 10(-6.4,-1.255) 10(6.4,-1.255)
USB3.0-TH_U235-09XN-2XC2-002
  round 1.5 hole 0.9: 1(1.25,-1.09) 2(-1.25,-1.09) 3(-1.25,-4.39) 4(1.25,-4.39)
  round 1.3 hole 0.7: 5(-4.25,2.21) 6(-2.5,2.21) 7(0,2.21) 8(2.5,2.21) 9(4.25,2.21)
  round 3 hole 2.3: 10(-6,-1.61) 10(6,-1.61)
  rect 2.9x1 hole 2.5x0.6: 11(0,4.39)
WT32-ETH01-M
  round 1.524 hole 0.914: 1(-13.529,12.027) 2(-10.989,12.027) 3(-8.449,12.027) 4(-5.909,12.027) 5(-3.369,12.027) 6(-0.829,12.027) 7(1.711,12.027) 8(4.251,12.027) 9(6.791,12.027) 10(9.331,12.027) 11(11.871,12.027) 12(14.411,12.027) 13(16.951,12.027) 14(-13.529,-10.833) 15(-10.989,-10.833) 16(-8.449,-10.833) 17(-5.909,-10.833) 18(-3.369,-10.833) 19(-0.829,-10.833) 20(1.711,-10.833) 21(4.251,-10.833) 22(6.791,-10.833) 23(9.331,-10.833) 24(11.871,-10.833) 25(14.411,-10.833) 26(16.951,-10.833)

## Nets
As in the schematic.

Pads without a net: MH1 1; MH2 1; MH5 1; MH6 1; MH7 1; MH8 1; U1 1 10 13 17 24 25 26

## Via types
v1: diameter 0.61, hole 0.305, Top Layer to Bottom Layer, 70 vias

## Routing (per net, layer and track width the routed paths; a pad name or vN(x,y) marks a point on that pad's centre or on a via; arc(x,y) is an arc through that point)
+3.3V: length 4.4
  Top Layer w0.254: v1(47.43,75.86) 49.27,75.86 LED7.2 ; R2.1 v1(41.13,43.04) R8.2
+5V: length 126.7
  Top Layer w0.6: C2.1 23.7,48.25 SW1.1 18.54,48.25 17.53,47.24 17.53,44.29 18.13,43.69 19.21,43.69 20.07,42.83 20.07,33.02 21.81,31.27 33.64,31.27 ; C2.1 24.14,49.4 LED-POWER1.1 ; C2.1 29.11,47.82 IC1.3 32.13,47.71 32.73,48.31 32.73,53.63 27.43,58.93 25.52,58.93 24.64,59.81 24.64,62.26 U1.2 ; 48.77,19.05 48.77,18.79 49.53,18.03 54.36,18.03 55.63,19.3 55.63,24.89 56.9,26.16 59.44,26.16 60.71,27.43 60.71,30.48 59.91,31.27 56.66,31.27 56.64,31.26 ; 33.64,31.27 36.07,31.27 36.08,31.26 38.61,31.26 ; 33.64,31.27 33.64,27.57 35.05,26.16 40.13,26.16 41.27,25.02 RLY1.1 41.27,18.67 41.91,18.03 47.75,18.03 48.77,19.05
  Top Layer w0.718: 48.77,19.05 RLY2.1
GND: length 27.7
  Top Layer w0.254: Q4.2 72.39,51.21 v1(72.39,50.29) ; 81.03,52.72 81.04,52.7 v1(82.04,52.7) ; 67.56,51.42 67.55,51.44 v1(66.29,51.44)
  Top Layer w0.28: v1(82.04,25.4) 81.09,25.4 80.98,25.29 ; v1(72.36,22.78) Q3.2 ; v1(23.37,74.17) 21.48,74.17 OP2.3 ; R23.2 37.26,42.93 v1(36.07,42.93) 34.99,42.93 R22.2 ; OP1.3 9.8,74.17 v1(11.68,74.17) ; v1(66.25,23.99) 67.52,23.99 ; R24.1 36.51,72.97 Q8.2 36.37,74.17 v1(35.56,74.17)
  Top Layer w0.718: USB2.7 v1(74.8,44.32) ; USB2.4 v1(71.8,38.48) ; 74.81,68.97 v1(74.81,71.75) ; 71.81,68.97 v1(71.81,65.91)
  vias: v1(33.27,42.93) v1(39.37,33.02) v1(47.5,28.19) v1(55.88,33.02)
GND-DHT: length 48.1
  Top Layer w0.254: R26.2 49.28,88.87
  Top Layer w0.6: 49.28,87.09 49.26,87.1 ; 49.26,87.1 CN3.1 CN4.1 ; 49.26,87.1 CN5.1 CN2.1 33.76,87.1 32.51,85.85 32.51,80.66 35.56,77.61 Q8.3
VCC: length 20.8
  Top Layer w0.6: IC1.1 29.21,55.12 27.94,56.39 18.13,56.39 17.53,55.79 17.53,52.83 18.1,52.25 SW1.3
VCC-IN: length 5.8
  Top Layer w0.6: SW1.2 20.05,50.53 J1.1
GPIO2: length 116.5
  Top Layer w0.254: R25.2 36.31,70.35 35.56,69.6 34.04,69.6 33.27,70.36 33.27,76.88 31.24,78.91 31.24,83.06 30.21,84.09 10.3,84.09 7.37,81.15 7.37,70.61 8.89,69.09 8.89,66.71 10.56,65.04 25.13,65.04 25.92,64.25 25.92,60.44 26.42,59.94 27.94,59.94 37.59,50.29 37.59,45.72 36.58,44.7 29.94,44.7 U1.15
GPIO4: length 19.8
  Top Layer w0.254: R5.2 40.65,32.31 40.64,32.32 40.64,33.78 39.88,34.54 28.96,34.54 27.24,36.26 U1.16
GPIO5: length 28
  Top Layer w0.254: U1.7 37.4,66.86 40.64,70.1 40.64,83.82 41.4,84.58 45.47,84.58
GPIO12: length 28.6
  Top Layer w0.254: R6.2 54.47,34.68 53.59,35.56 33.78,35.56 32.32,37.02 U1.18
GPIO14: length 52.6
  Top Layer w0.254: 70.82,23.99 70.81,23.99 LED5.2 69.18,23.46 68.58,22.86 63.5,22.86 61.98,24.38 61.98,34.8 60.2,36.58 36.34,36.58 34.86,38.06 U1.19 34.86,41.52 R22.1
GPIO15: length 48.8
  Top Layer w0.254: R23.1 37.38,39.47 U1.20 37.4,38.42 38.23,37.59 60.2,37.59 61.98,39.37 61.98,49.28 62.99,50.29 68.71,50.29 69.22,50.8 LED6.2 70.86,51.43 70.87,51.42
GPIO17: length 25.9
  Top Layer w0.254: U1.6 34.86,66.86 39.12,71.12 39.12,84.07 38.59,84.6 CN2.2
GPIO32: length 40.3
  Top Layer w0.254: U1.9 42.42,62.38 42.42,66.8 43.69,68.07 57.15,68.07 58.42,69.34 58.42,83.57 59.46,84.6 CN4.2
GPIO33: length 39.7
  Top Layer w0.254: CN3.2 56.37,84.6 56.9,84.07 56.9,70.36 56.13,69.6 42.67,69.6 39.94,66.86 U1.8
GPIO36: length 54.7
  Top Layer w0.254: U1.21 39.88,39.52 R2.2 39.63,41.78 38.99,41.78 38.61,42.16 38.61,50.67 28.45,60.83 28.45,64.64 27.18,65.91 10.92,65.91 9.67,67.17 OP1.4
GPIO39: length 45.8
  Top Layer w0.254: OP2.4 21.35,68.18 22.61,66.93 27.43,66.93 30.99,63.37 30.99,61.34 40.98,51.35 40.98,45.51 41.82,44.67 42.84,44.67 43.69,43.81 43.69,42.29 43.18,41.78 42.66,41.78 R8.1 42.42,39.52 U1.22
USBSW1_D+: length 10
  Top Layer w0.28: 73.81,41.56 73.81,39.75 74.42,39.14 75.52,39.14 77.24,37.42 77.24,35.68 76.9,35.33 76.38,35.33 76.06,35.65 76.06,36.29
USBSW1_D-: length 10.1
  Top Layer w0.28: 75.81,41.56 75.81,39.53 77.72,37.62 77.72,34.65 76.06,32.99
USBSW1_SSRX+: length 33.9
  Top Layer w0.28: USB2.9 78.8,41.55 78.8,43.26 78.04,44.02 78.04,46.22 78.54,46.73 82.81,46.73 83,46.53 83,42.1 81.28,40.38 81.28,36.31 83.2,34.4 83.2,32.31 82.1,31.21 79.38,31.21 78.89,31.7 78.43,31.7 77.3,30.56 77.3,29.67 USB1.6
USBSW1_SSRX-: length 33.9
  Top Layer w0.28: USB2.8 76.8,41.55 76.8,43.26 77.56,44.02 77.56,46.42 78.35,47.21 83,47.21 83.48,46.73 83.48,41.9 81.76,40.18 81.76,36.51 83.68,34.6 83.68,32.11 82.3,30.73 79.25,30.73 79.05,30.52 79.05,29.67 USB1.5
USBSW1_SSTX+: length 33.9
  Top Layer w0.28: USB2.6 72.8,41.55 72.8,43.26 72.04,44.02 72.04,46.42 71.25,47.21 66.59,47.21 66.11,46.73 66.11,41.9 67.83,40.18 67.83,36.51 65.91,34.59 65.91,32.11 67.3,30.73 70.34,30.73 70.55,30.52 70.55,29.67 USB1.9
USBSW1_SSTX-: length 33.9
  Top Layer w0.28: USB1.8 72.3,29.67 72.3,30.57 71.17,31.7 70.7,31.7 70.21,31.21 67.49,31.21 66.39,32.31 66.39,34.39 68.31,36.31 68.31,40.38 66.59,42.1 66.59,46.53 66.79,46.73 71.05,46.73 71.56,46.22 71.56,44.02 70.8,43.26 70.8,41.54 USB2.5
USBSW1_VBUS1: length 14.1
  Top Layer w0.3: 75.9,23.99 75.17,23.99 74.65,23.47 73.87,23.47 73.43,23.91 73.43,26.19 73.23,26.39
  Top Layer w0.5: 72.6,27.03 73.23,26.39
  Top Layer w0.6: 75.9,23.99 77.09,23.99 Q6.2
  Top Layer w0.718: USB1.1 73.55,29.1 72.6,28.15 72.6,27.03
USBSW1_VBUS2: length 22.2
  Top Layer w0.718: C3.2 80.13,24.2 Q6.3 79.59,27.15 78.69,28.05 77.11,28.05 76.07,29.09 76.07,30.6 78.61,33.15 78.61,38.29 77.8,39.1 USB2.1
USBSW2_D+: length 10
  Top Layer w0.28: USB4.3 73.81,67.16 74.42,66.55 75.52,66.55 77.24,64.83 77.24,63.09 76.9,62.74 76.38,62.74 76.06,63.06 USB3.3
USBSW2_D-: length 10.1
  Top Layer w0.28: USB3.2 77.72,62.06 77.72,65.02 75.81,66.94 USB4.2
USBSW2_SSRX+: length 33.9
  Top Layer w0.28: 78.81,68.97 78.81,70.7 78.05,71.46 78.05,73.66 78.56,74.17 82.82,74.17 83.02,73.97 83.02,69.54 81.29,67.82 81.29,63.76 83.21,61.84 83.21,59.75 82.11,58.65 79.39,58.65 78.9,59.14 78.45,59.14 77.31,58.01 77.31,57.09
USBSW2_SSRX-: length 33.9
  Top Layer w0.28: 79.06,57.1 79.06,57.97 79.26,58.17 82.31,58.17 83.69,59.55 83.69,62.04 81.77,63.96 81.77,67.62 83.5,69.35 83.5,74.17 83.02,74.65 78.36,74.65 77.57,73.86 77.57,71.46 76.81,70.7 76.81,68.97
USBSW2_SSTX+: length 33.9
  Top Layer w0.28: USB3.9 70.56,57.96 70.36,58.17 67.31,58.17 65.93,59.55 65.93,62.03 67.85,63.95 67.85,67.62 66.12,69.34 66.12,74.17 66.6,74.65 71.26,74.65 72.05,73.86 72.05,71.46 72.81,70.7 USB4.6
USBSW2_SSTX-: length 33.9
  Top Layer w0.28: USB3.8 72.31,57.99 71.16,59.14 70.72,59.14 70.23,58.65 67.51,58.65 66.41,59.75 66.41,61.84 68.33,63.75 68.33,67.82 66.6,69.54 66.6,73.97 66.8,74.17 71.06,74.17 71.57,73.66 71.57,71.46 70.81,70.7 USB4.5
USBSW2_VBUS1: length 14.1
  Top Layer w0.3: 73.26,53.82 73.46,53.62 73.46,51.34 73.89,50.9 74.68,50.9 75.19,51.42 75.92,51.42
  Top Layer w0.5: 72.62,54.46 73.26,53.82
  Top Layer w0.718: 75.95,51.42 77.14,51.42 Q7.2 ; 73.58,60.39 73.58,56.56 72.62,55.6 72.62,54.46
USBSW2_VBUS2: length 22.1
  Top Layer w0.718: 77.81,68.97 77.81,66.53 78.49,65.85 78.49,60.58 76.07,58.17 76.07,56.51 77.12,55.47 78.7,55.47 79.6,54.58 79.6,52.17 ; C4.2 80.18,51.63 Q7.3
$1N3: length 21.7
  Top Layer w0.254: 45.51,27.13 45.09,27.56 42.16,27.56 ; 45.51,27.13 46.32,27.94 Q1.3 ; 45.51,27.13 45.97,26.67 RLY1.4 ; 42.16,27.56 R12.2 ; 42.16,27.56 36.96,27.56 36.32,28.19 D1.2
$1N5: length 3.5
  Top Layer w0.254: Q1.1 43.28,31.62 R5.1 R10.2
$1N16: length 1.5
  Top Layer w0.6: LED-POWER1.2 24.14,51.01 R7.1
$1N18: length 21.4
  Top Layer w0.254: 52.97,27.56 49.66,27.56 48.8,28.41 Q2.3 ; 52.97,27.56 R13.2 ; 52.97,27.56 53.45,27.56 ; RLY2.4 53.47,27.53 53.45,27.56 ; 53.45,27.56 58.29,27.56 58.93,28.19 D2.2
$1N19: length 3.2
  Top Layer w0.254: 56.64,29.82 56.64,28.96 56.26,28.58 R13.1
$1N25: length 3.6
  Top Layer w0.254: R6.1 R11.2 52.22,30.1 51.27,29.15
$1N58: length 11.6
  Top Layer w0.254: OP1.1 14.22,71.75 13.72,72.26 13.72,74.8 12.95,75.56 10.92,75.56 10.67,75.82 10.67,76.29 R1.1
$1N59: length 7.8
  Top Layer w0.254: CN1.4 11.91,81.72 R1.2 13.89,76.56 LED1.2
$1N4552: length 10
  Top Layer w3: JP2.3 JP2.4
  Bottom Layer w3: JP2.3 JP2.4
  vias: v1(70.53,8.51) v1(70.53,6.87)
$1N4588: length 9.8
  Top Layer w3: 41.27,8.93 39.96,7.62 JP1.6
  Bottom Layer w3: 41.27,8.93 39.96,7.62 JP1.6
  vias: v1(38.65,6.86) v1(39.37,8.38) v1(40.13,6.86)
$1N4592: length 28.7
  Top Layer w3: 41.27,1.93 33.13,1.93 31.89,3.17 JP1.5
  Bottom Layer w3: 41.27,1.93 33.13,1.93 31.89,3.17 JP1.5
  vias: v1(30.99,5.59) v1(30.99,4.06) v1(31.24,2.54) v1(32.26,1.52) v1(32.77,5.59) v1(32.77,4.06) v1(33.78,2.79) v1(33.78,1.02) v1(35.56,2.79) v1(35.56,1.02) v1(37.34,2.79) v1(37.34,1.02) v1(39.12,2.79) v1(39.12,1.02)
$1N4597: length 10
  Top Layer w3: JP1.3 JP1.4
  Bottom Layer w3: JP1.3 JP1.4
  vias: v1(24.31,8.4) v1(24.31,6.71)
$1N4602: length 10
  Top Layer w3: JP1.1 JP1.2
  Bottom Layer w3: JP1.1 JP1.2
  vias: v1(14.22,8.25) v1(14.22,6.76)
$1N4658: length 38.6
  Top Layer w3: JP2.2 63.11,3.17 61.87,1.93 48.77,1.93
  Bottom Layer w3: 48.77,1.93 61.87,1.93 63.11,3.17 JP2.2
  vias: v1(50.8,2.79) v1(50.77,1.02) v1(52.69,2.79) v1(52.66,1.02) v1(54.58,2.79) v1(54.55,1.02) v1(56.44,1.02) v1(56.47,2.79) v1(58.33,1.02) v1(58.36,2.79) v1(60.22,1.02) v1(60.25,2.79) v1(62.23,5.22) v1(62.23,3.3) v1(62.48,1.52) v1(63.89,5.22) v1(63.89,3.27)
$1N4661: length 19.8
  Top Layer w3: JP2.1 50.08,7.62 48.77,8.93
  Bottom Layer w3: 48.77,8.93 50.08,7.62 JP2.1
  vias: v1(49.78,6.73) v1(50.67,8.38) v1(51.69,6.73) v1(52.45,8.38) v1(53.47,6.73) v1(54.38,8.38) v1(55.22,6.73) v1(56.01,8.38)
$1N4663: length 10
  Top Layer w3: JP2.5 JP2.6
  Bottom Layer w3: JP2.5 JP2.6
  vias: v1(80.77,8.25) v1(80.77,6.82)
$1N12669: length 9.6
  Top Layer w0.254: CN1.3 18.54,82.17 19.08,81.63 R3.1 19.08,75.11 OP1.2
$1N27876: length 16.8
  Top Layer w0.254: OP2.2 25.65,74.3 24.38,75.56 21.34,75.56 21.11,75.8 R4.2 21.11,81.68 21.59,82.17 CN1.2
$1N27969: length 2.1
  Top Layer w0.254: LED1.1 17.56,76.57 R3.2
$1N27997: length 8
  Top Layer w0.254: CN1.1 27.36,79.7 28.28,78.79 R9.1 28.27,76.56 LED2.2
$1N28002: length 8.6
  Top Layer w0.254: OP2.1 31.5,71.75 32.26,72.52 32.26,75.56 31.5,76.33 30.01,76.33 R9.2
$1N28006: length 2.1
  Top Layer w0.254: R4.1 24.69,76.56 LED2.1
$1N30826: length 2.2
  Top Layer w0.254: R12.1 39.09,28.58 LED3.1
$1N38985: length 1.6
  Top Layer w0.254: Q3.1 72.16,25.5 R17.1
$1N38986: length 3.3
  Top Layer w0.254: Q6.1 77.09,25.5 R20.1 75.11,25.5 Q3.3
$1N41846: length 1.6
  Top Layer w0.254: Q4.1 72.21,52.93 R18.1
$1N41847: length 3.3
  Top Layer w0.254: Q7.1 77.14,52.93 R21.1 75.16,52.93 Q4.3
$1N49685: length 1.7
  Top Layer w0.254: R14.2 69.08,25.5 69.17,25.59
$1N49709: length 1.7
  Top Layer w0.254: 69.21,53.03 69.12,52.93 R15.2
$1N52596: length 3.1
  Top Layer w0.254: R25.1 R24.2 34.81,74.12 Q8.1
$1N53145: length 2
  Top Layer w0.254: R26.1 49.28,78.19

## Copper pours and planes (outline as drawn; the poured copper is in the pictures)
+3.3V on Inner2: 0.26,89.74 94.74,89.74 94.74,13.72 0.26,13.72
GND on Top Layer: 7.62,56.9 30.99,56.9 30.99,44.7 7.62,44.7
GND on Top Layer: 38.61,34.04 57.15,34.04 57.15,26.92 38.61,26.92
GND on Bottom Layer: 0,90 95,90 95,13.8 0,13.8
GND on Inner1: 0.26,89.74 94.74,89.74 94.74,13.72 0.26,13.72

Small or netless copper shapes (teardrops, artwork), in the pictures only: 100 on Inner1, 24 on Inner2

## Text on the board
Top Silkscreen Layer: JLCJLCJLCJLC | GND | DAT | VCC | POWER | REV 3 | 6-24V | 5V | Input 3V-24V | USB Switch 2 | USB Switch 1 | 1 | 2 | N | E | L | O | O1 | O2
